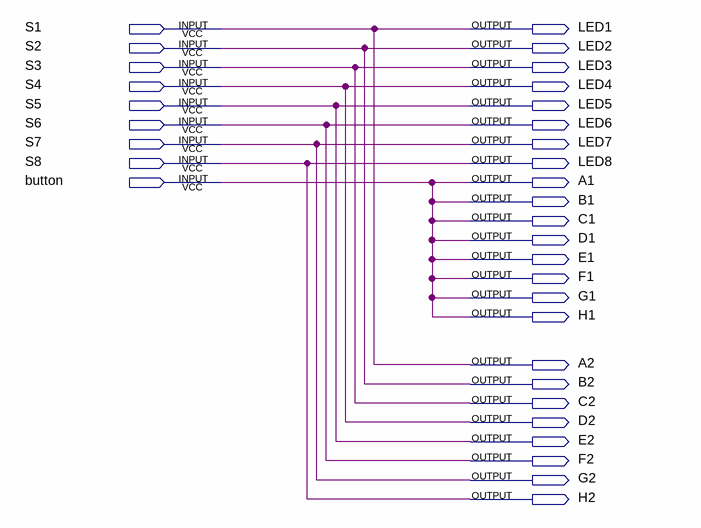
[diagram p0: schematic sheet]
// Quartus schematic Base_old.bdf as structural Verilog: 0 symbols, 33 pins
module Base_old (
  input  S1,
  input  S2,
  input  S3,
  input  S4,
  input  S5,
  input  S6,
  input  S7,
  input  S8,
  input  button,
  output LED1,
  output LED2,
  output LED3,
  output LED4,
  output LED5,
  output LED6,
  output LED7,
  output LED8,
  output A1,
  output B1,
  output C1,
  output D1,
  output E1,
  output F1,
  output G1,
  output H1,
  output A2,
  output B2,
  output C2,
  output D2,
  output E2,
  output F2,
  output G2,
  output H2
);


  assign A1 = button;
  assign A2 = S1;
  assign B1 = button;
  assign B2 = S2;
  assign C1 = button;
  assign C2 = S3;
  assign D1 = button;
  assign D2 = S4;
  assign E1 = button;
  assign E2 = S5;
  assign F1 = button;
  assign F2 = S6;
  assign G1 = button;
  assign G2 = S7;
  assign H1 = button;
  assign H2 = S8;
  assign LED1 = S1;
  assign LED2 = S2;
  assign LED3 = S3;
  assign LED4 = S4;
  assign LED5 = S5;
  assign LED6 = S6;
  assign LED7 = S7;
  assign LED8 = S8;
endmodule
